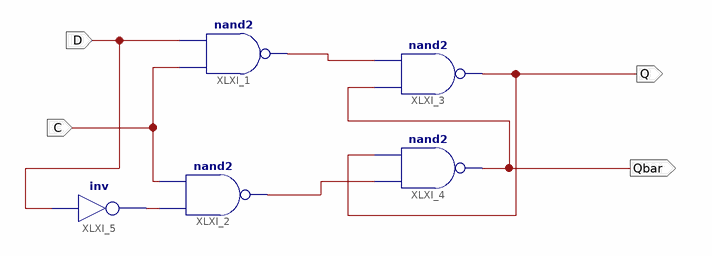
[diagram p0: schematic sheet 1]
// Xilinx ISE schematic D_LATCH.sch (kintex7) as structural Verilog: 5 symbols, 4 ports
module D_LATCH (
  input  C,
  input  D,
  output Q,
  output Qbar
);

  wire XLXN_1, XLXN_2, XLXN_7;

  nand XLXI_1 (XLXN_1, C, D);
  nand XLXI_2 (XLXN_2, XLXN_7, C);
  nand XLXI_3 (Q, Qbar, XLXN_1);
  nand XLXI_4 (Qbar, XLXN_2, Q);
  not XLXI_5 (XLXN_7, D);
endmodule
